# Altium schematic sheet BoardForIV.SchDoc
size 558 x 431 mm; SheetNumber: 1; SheetTotal: 1
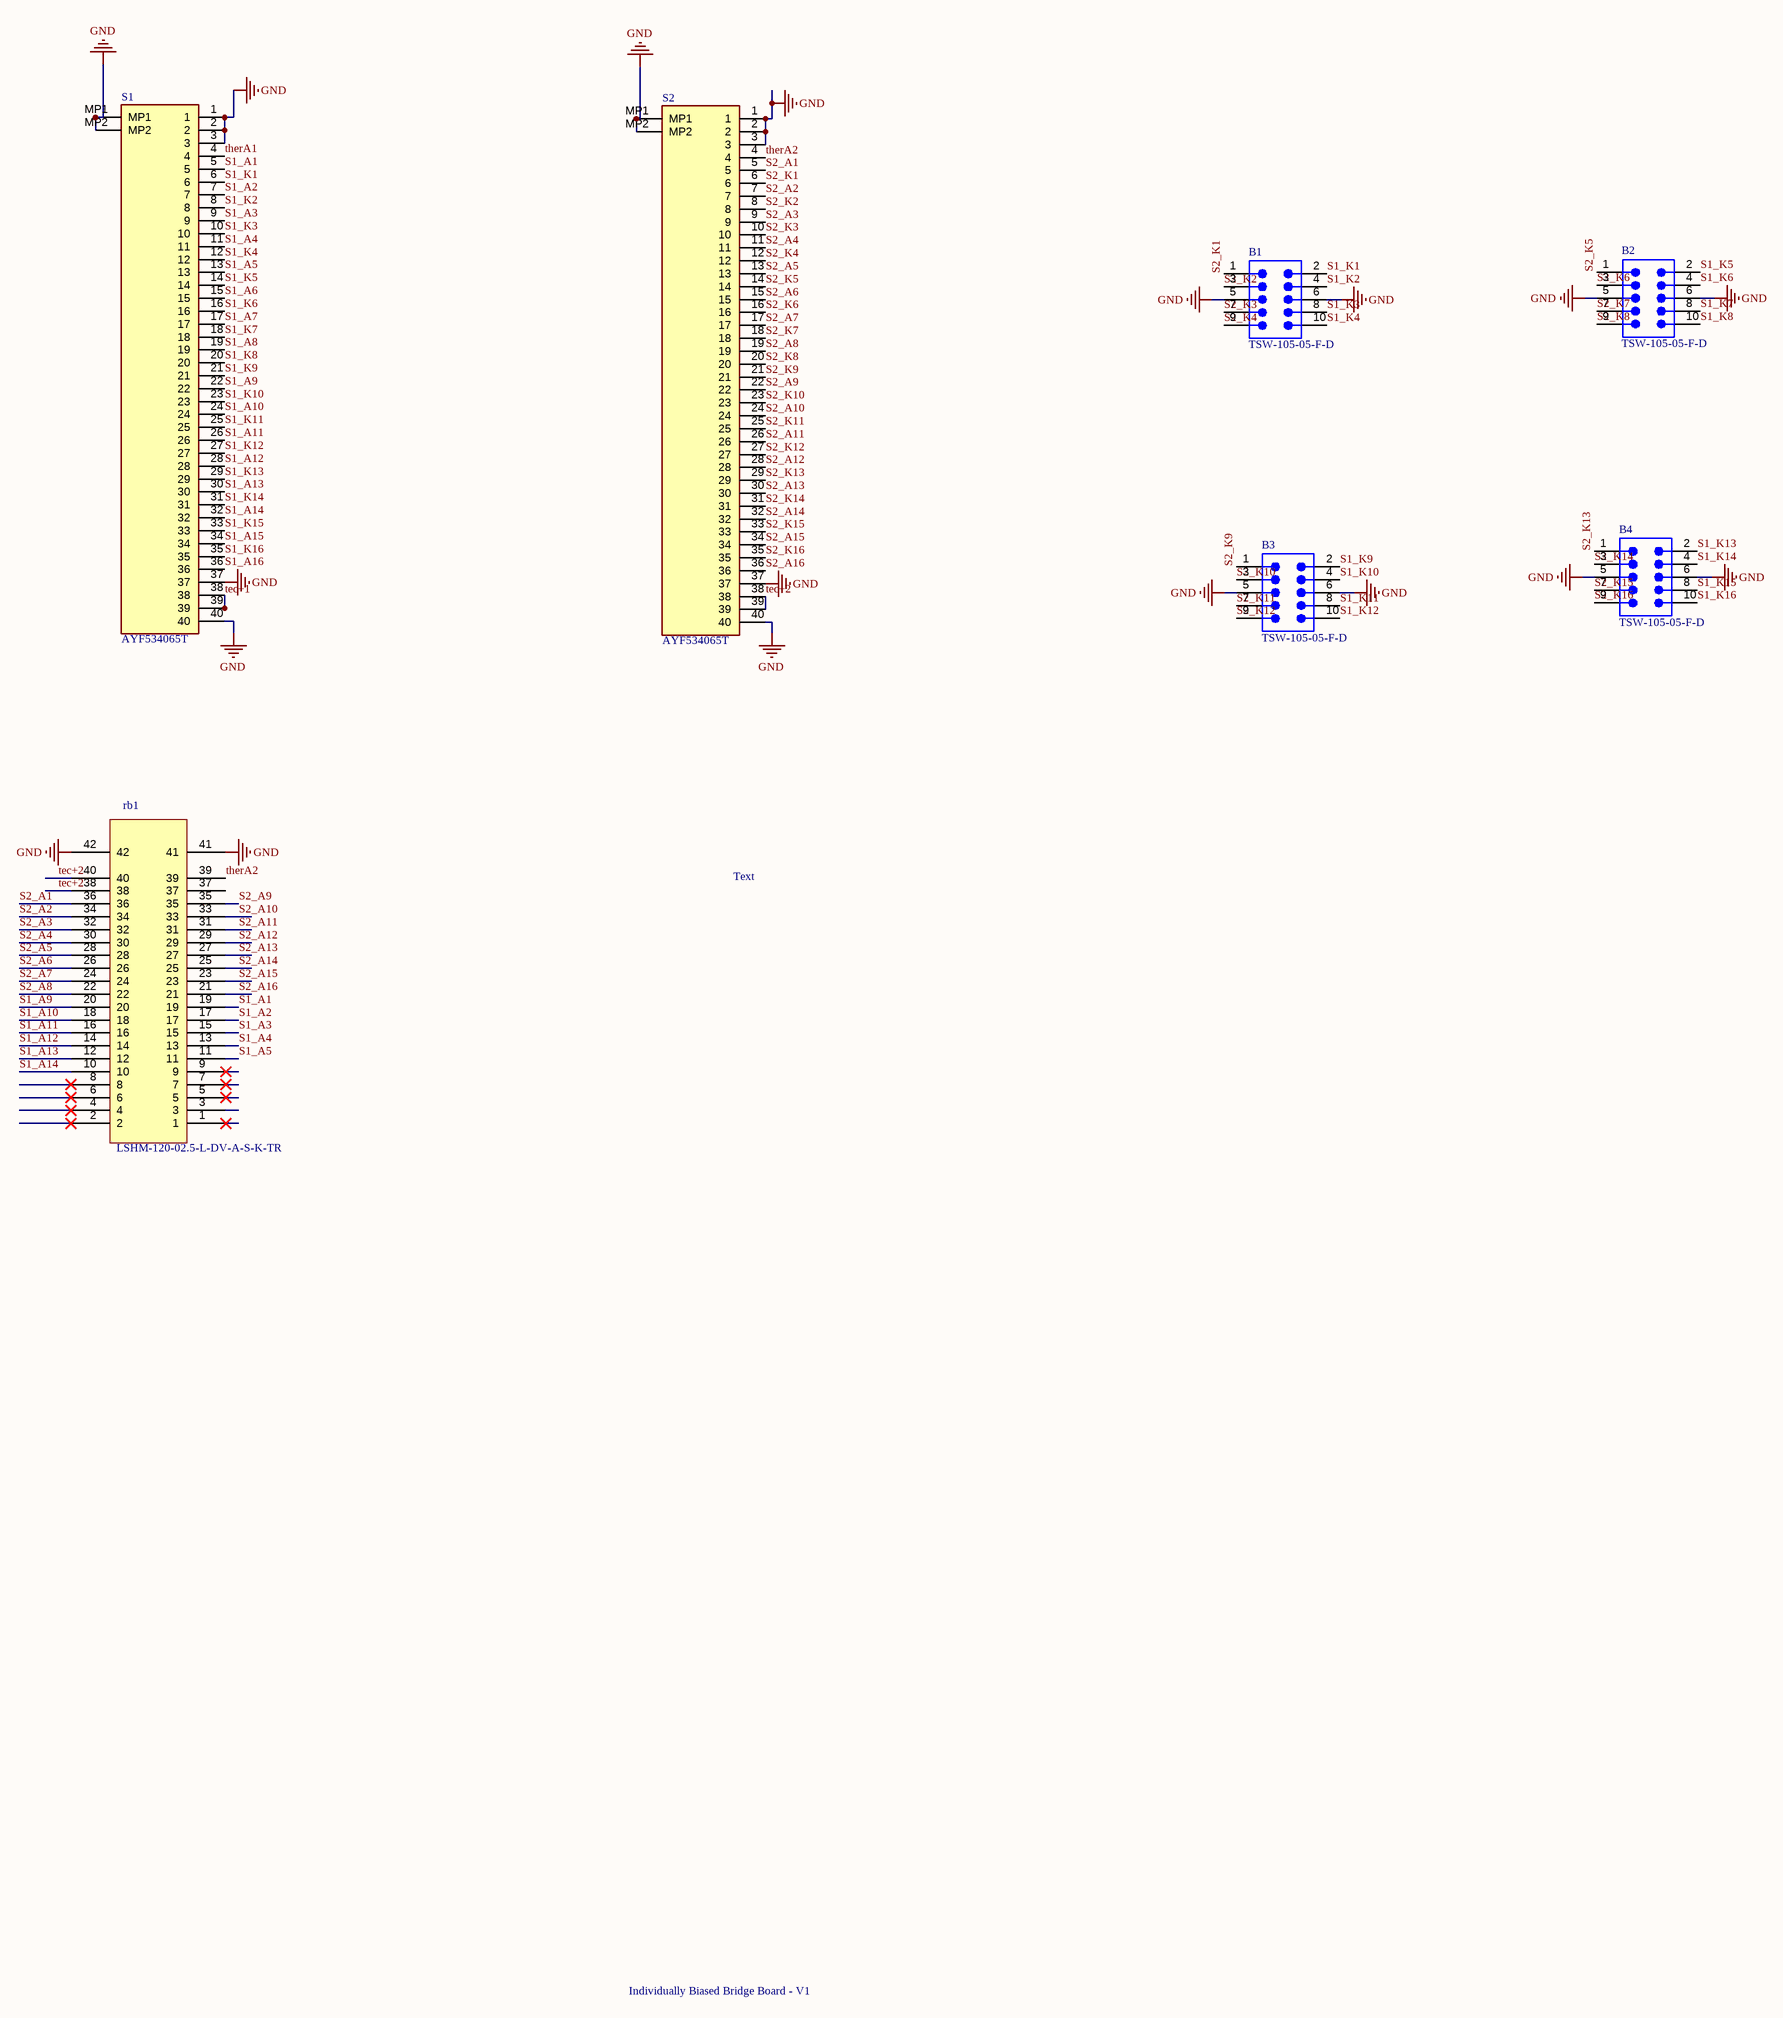
[diagram p0: BoardForIV.SchDoc]

## Parts
B1  TSW-105-05-F-D  [SMTC-TSW-105-05-X-D]
B2  TSW-105-05-F-D  [SMTC-TSW-105-05-X-D]
B3  TSW-105-05-F-D  [SMTC-TSW-105-05-X-D]
B4  TSW-105-05-F-D  [SMTC-TSW-105-05-X-D]
rb1  LSHM-120-02.5-L-DV-A-S-K-TR  [SAMTEC_LSHM-120-02.5-L-DV-A-S-TR]
S1  AYF534065T  [AYF534065T]
S2  AYF534065T  [AYF534065T]

## Nets
GND: B1.5 B1.6 B2.5 B2.6 B3.5 B3.6 B4.5 B4.6 rb1.41 rb1.42 S1.1 S1.2 S1.3 S1.37 S1.40 S1.MP1 S1.MP2 S2.1 S2.2 S2.3 S2.37 S2.40 S2.MP1 S2.MP2
S1_A1: rb1.19 S1.5
S1_A2: rb1.17 S1.7
S1_A3: rb1.15 S1.9
S1_A4: rb1.13 S1.11
S1_A5: rb1.11 S1.13
S1_A6: S1.15
S1_A7: S1.17
S1_A8: S1.19
S1_A9: rb1.20 S1.22
S1_A10: rb1.18 S1.24
S1_A11: rb1.16 S1.26
S1_A12: rb1.14 S1.28
S1_A13: rb1.12 S1.30
S1_A14: rb1.10 S1.32
S1_A15: S1.34
S1_A16: S1.36
S1_K1: B1.2 S1.6
S1_K2: B1.4 S1.8
S1_K3: B1.8 S1.10
S1_K4: B1.10 S1.12
S1_K5: B2.2 S1.14
S1_K6: B2.4 S1.16
S1_K7: B2.8 S1.18
S1_K8: B2.10 S1.20
S1_K9: B3.2 S1.21
S1_K10: B3.4 S1.23
S1_K11: B3.8 S1.25
S1_K12: B3.10 S1.27
S1_K13: B4.2 S1.29
S1_K14: B4.4 S1.31
S1_K15: B4.8 S1.33
S1_K16: B4.10 S1.35
S2_A1: rb1.36 S2.5
S2_A2: rb1.34 S2.7
S2_A3: rb1.32 S2.9
S2_A4: rb1.30 S2.11
S2_A5: rb1.28 S2.13
S2_A6: rb1.26 S2.15
S2_A7: rb1.24 S2.17
S2_A8: rb1.22 S2.19
S2_A9: rb1.35 S2.22
S2_A10: rb1.33 S2.24
S2_A11: rb1.31 S2.26
S2_A12: rb1.29 S2.28
S2_A13: rb1.27 S2.30
S2_A14: rb1.25 S2.32
S2_A15: rb1.23 S2.34
S2_A16: rb1.21 S2.36
S2_K1: B1.1 S2.6
S2_K2: B1.3 S2.8
S2_K3: B1.7 S2.10
S2_K4: B1.9 S2.12
S2_K5: B2.1 S2.14
S2_K6: B2.3 S2.16
S2_K7: B2.7 S2.18
S2_K8: B2.9 S2.20
S2_K9: B3.1 S2.21
S2_K10: B3.3 S2.23
S2_K11: B3.7 S2.25
S2_K12: B3.9 S2.27
S2_K13: B4.1 S2.29
S2_K14: B4.3 S2.31
S2_K15: B4.7 S2.33
S2_K16: B4.9 S2.35
tec+1: S1.38 S1.39
tec+2: rb1.38 rb1.40 S2.38 S2.39
therA1: S1.4
therA2: rb1.39 S2.4

Not connected (* = marked no-connect by the designer): rb1 1* 2* 3 4* 5* 6* 7* 8* 9* 37

## Notes on the sheet
- Text
- Individually Biased Bridge Board - V1
- DWG. NO.
- REV.
- SHT.
- REVISION
- DESCRIPTION
- DATE
- APPROVED
- THIS DOCUMENT AND THE DATA DISCLOSED HEREIN OR HEREWITH IS THE PROPERTY OF ALTIUM LIMITED AND MAY BE FREELY DISTRIBUTED IN WHOLE. NO RIGHTS ARE RESERVED OR EXPRESS OR IMPLIED WARANTEE GIVEN.
- ENG:
- DSN:
- APPROVALS
- PROJECT
- DOCUMENT REVISION:
- DESIGN ITEM:
- CHK:
- BOM:
- REFERENCE DOCUMENTS
- PROJECT REVISION:
- TITLE
- FAB DWG:
- PCB DWG:
- ASSY DWG:
- SCALE:
- SIZE
- C
- CAGE CODE
- FILE NAME
- DWG NO.
- SHEET
- OF
- REV

## Library data of the parts
B1-B4 = CMP-1024-00360-1: 0.025" SQ Post Header, Through-hole, Vertical, -55 to 125 degC, 2.54 mm Pitch, 10-Pin, Male, RoHS; Manufacturer: Samtec; Pitch: 2.54 mm; PackageReference: TSW-105-05-X-D; PackageVersion: DM, 8/1988; ComponentLink3URL: http://www.samtec.com/documents/webfiles/cpdf/TSW-XXX-XX-XXX-X-XX-XXX-MKT.pdf; Mounting Technology: Through-hole; ComponentLink3Description: Package Specification; PackageDescription: .025[0.64] SQ. Post Terminal Strip Assembly; ComponentLink1URL: http://www.samtec.com; ComponentLink1Description: Manufacturer URL; ComponentLink2Description: Datasheet; PartNumber: TSW-105-05-F-D; ComponentLink2URL: http://www.samtec.com/documents/webfiles/pdf/TSW_TH.PDF; RoHS: True; Temperature Range: -55 to 125 degC; DatasheetVersion: F-214; Orientation: Vertical
rb1 = LSHM-120-02.5-L-DV-A-S-K-TR: razor beam 40
S1 S2 = AYF534035